# EAGLE design cob (EAGLE 8.1.1)
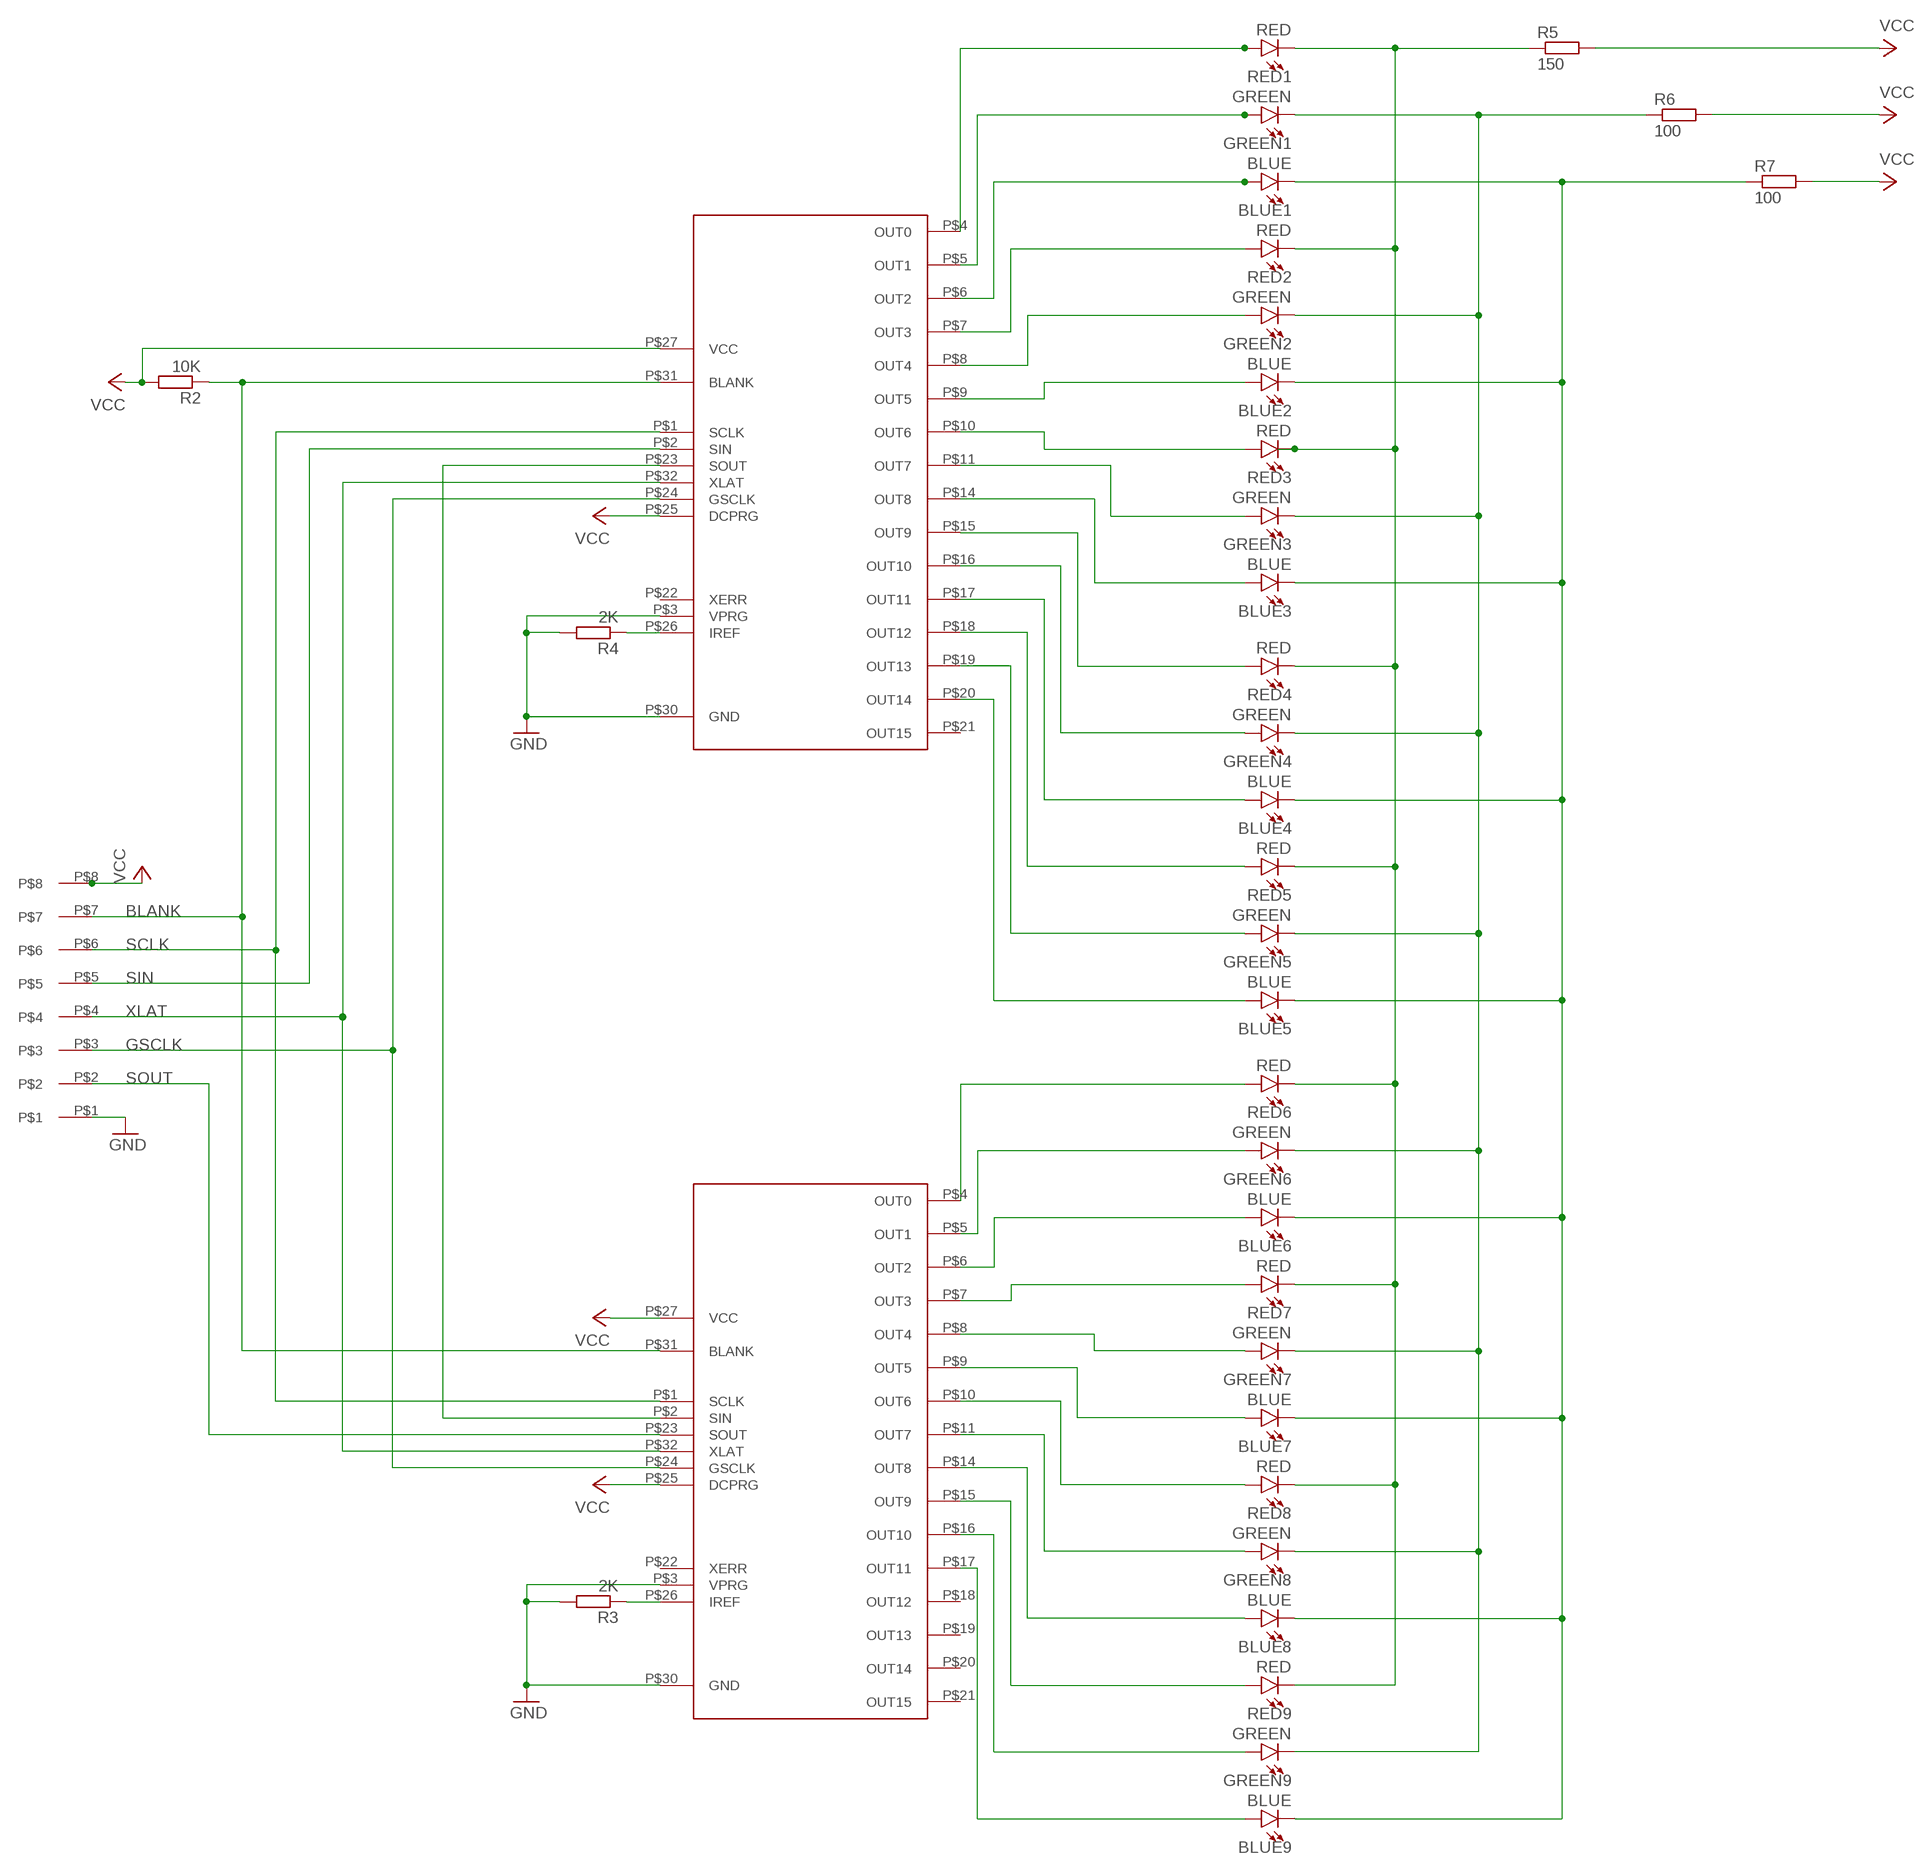
[diagram p0: schematic, sheet 1]

## Parts
BLUE1  BLUE  LED-BLUE0603  [LED-0603]
BLUE2  BLUE  LED-BLUE0603  [LED-0603]
BLUE3  BLUE  LED-BLUE0603  [LED-0603]
BLUE4  BLUE  LED-BLUE0603  [LED-0603]
BLUE5  BLUE  LED-BLUE0603  [LED-0603]
BLUE6  BLUE  LED-BLUE0603  [LED-0603]
BLUE7  BLUE  LED-BLUE0603  [LED-0603]
BLUE8  BLUE  LED-BLUE0603  [LED-0603]
BLUE9  BLUE  LED-BLUE0603  [LED-0603]
GREEN1  GREEN  LED-GREEN0603  [LED-0603]
GREEN2  GREEN  LED-GREEN0603  [LED-0603]
GREEN3  GREEN  LED-GREEN0603  [LED-0603]
GREEN4  GREEN  LED-GREEN0603  [LED-0603]
GREEN5  GREEN  LED-GREEN0603  [LED-0603]
GREEN6  GREEN  LED-GREEN0603  [LED-0603]
GREEN7  GREEN  LED-GREEN0603  [LED-0603]
GREEN8  GREEN  LED-GREEN0603  [LED-0603]
GREEN9  GREEN  LED-GREEN0603  [LED-0603]
R2  10K  R-EU_R0402  [R0402]
R3  2K  R-EU_R0402  [R0402]
R4  2K  R-EU_R0402  [R0402]
R5  150  R-EU_R1206  [R1206]
R6  100  R-EU_R1206  [R1206]
R7  100  R-EU_R1206  [R1206]
RED1  RED  LED-RED0603  [LED-0603]
RED2  RED  LED-RED0603  [LED-0603]
RED3  RED  LED-RED0603  [LED-0603]
RED4  RED  LED-RED0603  [LED-0603]
RED5  RED  LED-RED0603  [LED-0603]
RED6  RED  LED-RED0603  [LED-0603]
RED7  RED  LED-RED0603  [LED-0603]
RED8  RED  LED-RED0603  [LED-0603]
RED9  RED  LED-RED0603  [LED-0603]
U$1  TLC5940  [RHB]
U$2  TLC5940  [RHB]
U$3  8PIN  [8PIN]

## Nets
BLANK: R2.1 U$1.P$31(BLANK) U$2.P$31(BLANK) U$3.P$7
GND: R3.2 R4.2 U$1.P$3(VPRG) U$1.P$30(GND) U$2.P$3(VPRG) U$2.P$30(GND) U$3.P$1
GSCLK: U$1.P$24(GSCLK) U$2.P$24(GSCLK) U$3.P$3
N$1: RED1.A U$1.P$4(OUT0)
N$2: GREEN1.A U$1.P$5(OUT1)
N$3: RED2.A U$1.P$7(OUT3)
N$4: R4.1 U$1.P$26(IREF)
N$5: R3.1 U$2.P$26(IREF)
N$9: BLUE3.A U$1.P$14(OUT8)
N$10: BLUE2.A U$1.P$9(OUT5)
N$11: U$1.P$23(SOUT) U$2.P$2(SIN)
N$12: BLUE1.A U$1.P$6(OUT2)
N$13: GREEN2.A U$1.P$8(OUT4)
N$14: RED3.A U$1.P$10(OUT6)
N$15: GREEN3.A U$1.P$11(OUT7)
N$16: RED4.A U$1.P$15(OUT9)
N$17: GREEN4.A U$1.P$16(OUT10)
N$18: BLUE4.A U$1.P$17(OUT11)
N$19: RED5.A U$1.P$18(OUT12)
N$20: GREEN5.A U$1.P$19(OUT13)
N$21: BLUE5.A U$1.P$20(OUT14)
N$22: BLUE6.A U$2.P$6(OUT2)
N$23: GREEN6.A U$2.P$5(OUT1)
N$24: RED6.A U$2.P$4(OUT0)
N$25: RED7.A U$2.P$7(OUT3)
N$26: GREEN7.A U$2.P$8(OUT4)
N$27: BLUE7.A U$2.P$9(OUT5)
N$28: RED8.A U$2.P$10(OUT6)
N$29: GREEN8.A U$2.P$11(OUT7)
N$30: BLUE8.A U$2.P$14(OUT8)
N$31: BLUE9.A U$2.P$17(OUT11)
N$32: GREEN9.A U$2.P$16(OUT10)
N$33: RED9.A U$2.P$15(OUT9)
N$36: R5.1 RED1.C RED2.C RED3.C RED4.C RED5.C RED6.C RED7.C RED8.C RED9.C
N$38: GREEN1.C GREEN2.C GREEN3.C GREEN4.C GREEN5.C GREEN6.C GREEN7.C GREEN8.C GREEN9.C R6.1
N$39: BLUE1.C BLUE2.C BLUE3.C BLUE4.C BLUE5.C BLUE6.C BLUE7.C BLUE8.C BLUE9.C R7.1
SCLK: U$1.P$1(SCLK) U$2.P$1(SCLK) U$3.P$6
SIN: U$1.P$2(SIN) U$3.P$5
SOUT: U$2.P$23(SOUT) U$3.P$2
VCC: R2.2 R5.2 R6.2 R7.2 U$1.P$25(DCPRG) U$1.P$27(VCC) U$2.P$25(DCPRG) U$2.P$27(VCC) U$3.P$8
XLAT: U$1.P$32(XLAT) U$2.P$32(XLAT) U$3.P$4
Unconnected: U$1.P$21(OUT15) U$1.P$22(XERR) U$2.P$18(OUT12) U$2.P$19(OUT13) U$2.P$20(OUT14) U$2.P$21(OUT15) U$2.P$22(XERR)

## Library data of the parts
BLUE1-BLUE9 = SparkFun-LED:LED-BLUE: Blue SMD LED Used in manufacturing of various products at SparkFun Packages: 0603 - SMD 0603 package [Product Link] <http://www.digikey.com/product-detail/en/SMLE12BC7TT86/511-1589-2-ND/1641808> 1206 - SMD1206 package [Product Link] <http://www.digikey.com/product-detail/en/lite-on-inc/LTST-C150TBKT/160-1643-1-ND/573584> SparkFun Products: ESP8266 Thing-Dev Board <https://www.sparkfun.com/products/13711> RedBoard <https://www.sparkfun.com/products/12757>; PROD_ID: DIO-08575
GREEN1-GREEN9 = SparkFun-LED:LED-GREEN: Green SMD LED Used in manufacturing of various products at SparkFun Packages: 0603 - SMD 0603 package [Product Link] <http://www.futureelectronics.com/en/technologies/semiconductors/optoelectronics/leds/Pages/9894312-LTST-C190GKT.aspx?CrossPart=HSMG-C190&IM=0> LilyPad 1206 - SMD1206 LilyPad package [Product Link] <http://www.futureelectronics.com/en/Technologies/Product.aspx?ProductID=IN150NGHARVATEKCORPORATION2049943&IM=0> 1206 - SMD1206 package [Product Link] <http://www.futureelectronics.com/en/technologies/semiconductors/optoelectronics/leds/Pages/8315665-LTST-C150KGKT.aspx?IM=0> 1206 Bottom Mount -SMD 1206 Bottom Mount [Product Link] <http://www.digikey.com/product-detail/en/lite-on-inc/LTST-C230KGKT/160-1456-1-ND/386854> SparkFun Products: Pro Mini 328 -5V <https://www.sparkfun.com/products/821> RedBoard <https://www.sparkfun.com/products/12757> MP3 Trigger <https://www.sparkfun.com/products/13720> Makey Makey <https://www.sparkfun.com/products/11076>; PROD_ID: DIO-00821
R2-R7 = resistor:R-EU_: RESISTOR, European symbol
RED1-RED9 = SparkFun-LED:LED-RED: Red SMD LED Used in manufacturing of most products at SparkFun Packages: 0603 - SMD 0603 package [Product Link] <http://docs.avagotech.com/docs/AV02-0551EN> 0603 SMART - SMD 0603 SMART package ( more efficient and expensive)[Product Link] <http://www.osram-os.com/Graphics/XPic2/00077099_0.pdf> 1206 - SMD1206 package [Product Link] <https://www.sparkfun.com/datasheets/DevTools/LilyPad/Q150OVS4.pdff> SparkFun Products: Pro Mini 328 -5V <https://www.sparkfun.com/products/821> RedBoard <https://www.sparkfun.com/products/12757> IOIO-OTG <https://www.sparkfun.com/products/13613>; PROD_ID: DIO-00819
U$1 U$2 = spinner:TLC5940
U$3 = spinner:8PIN

## Board
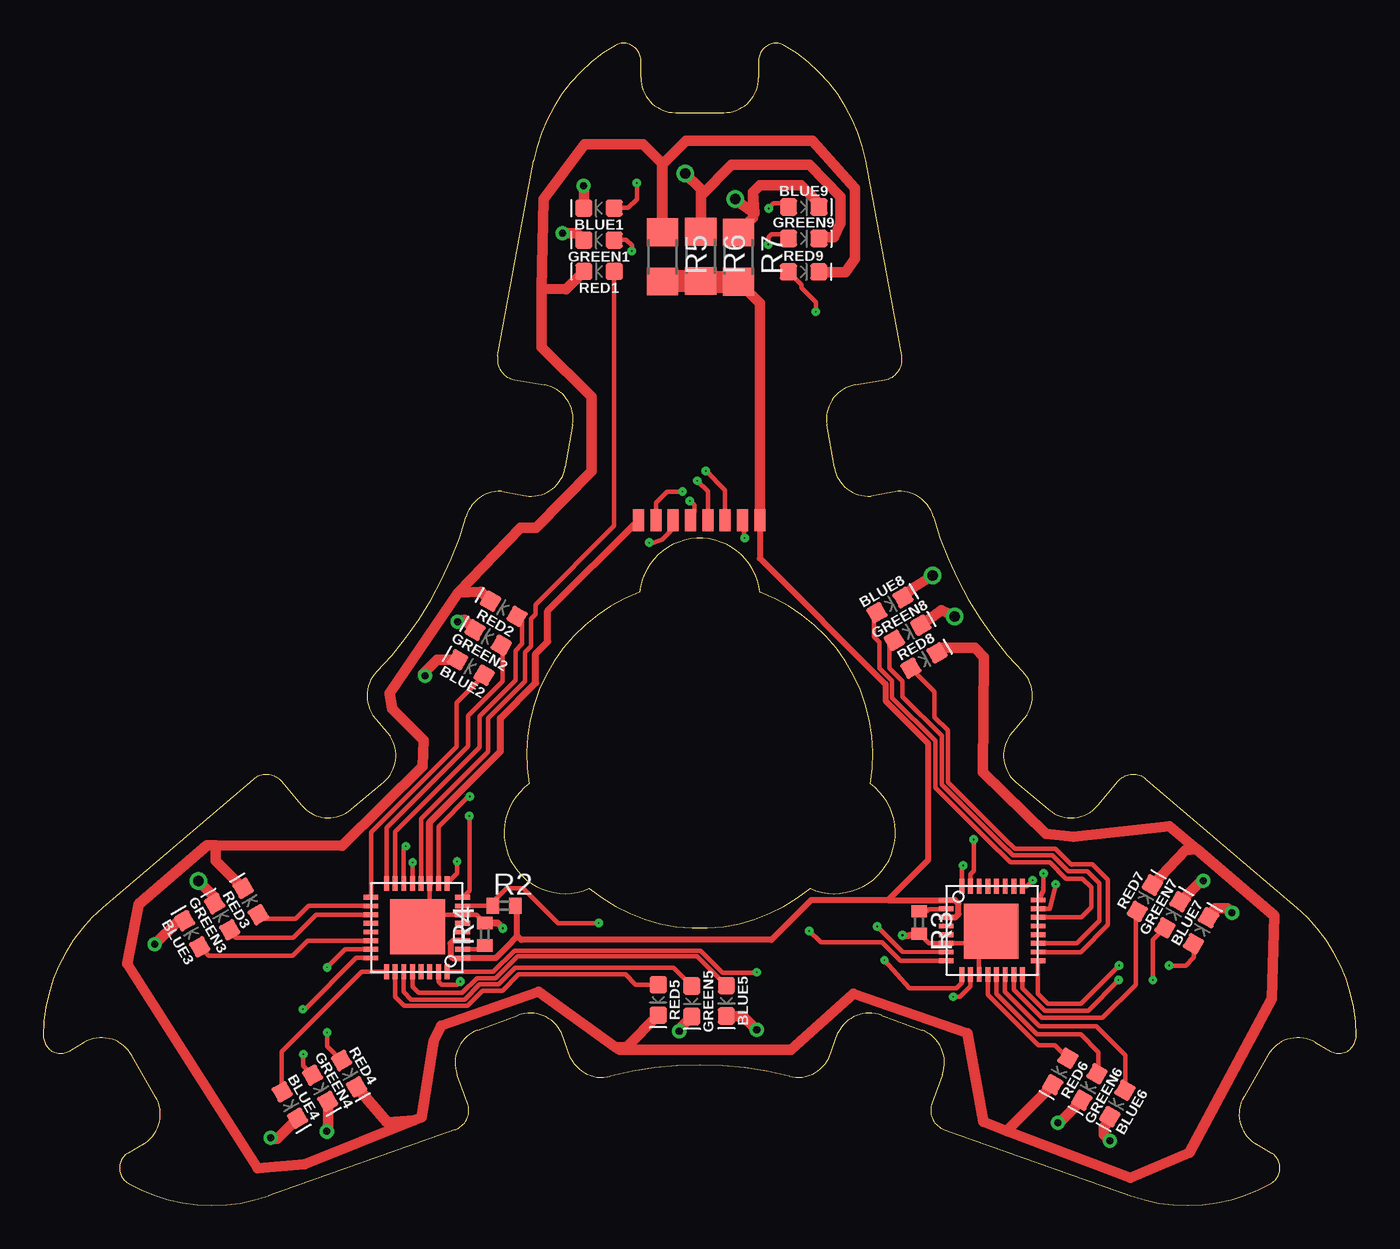
[diagram p1: board, top side]
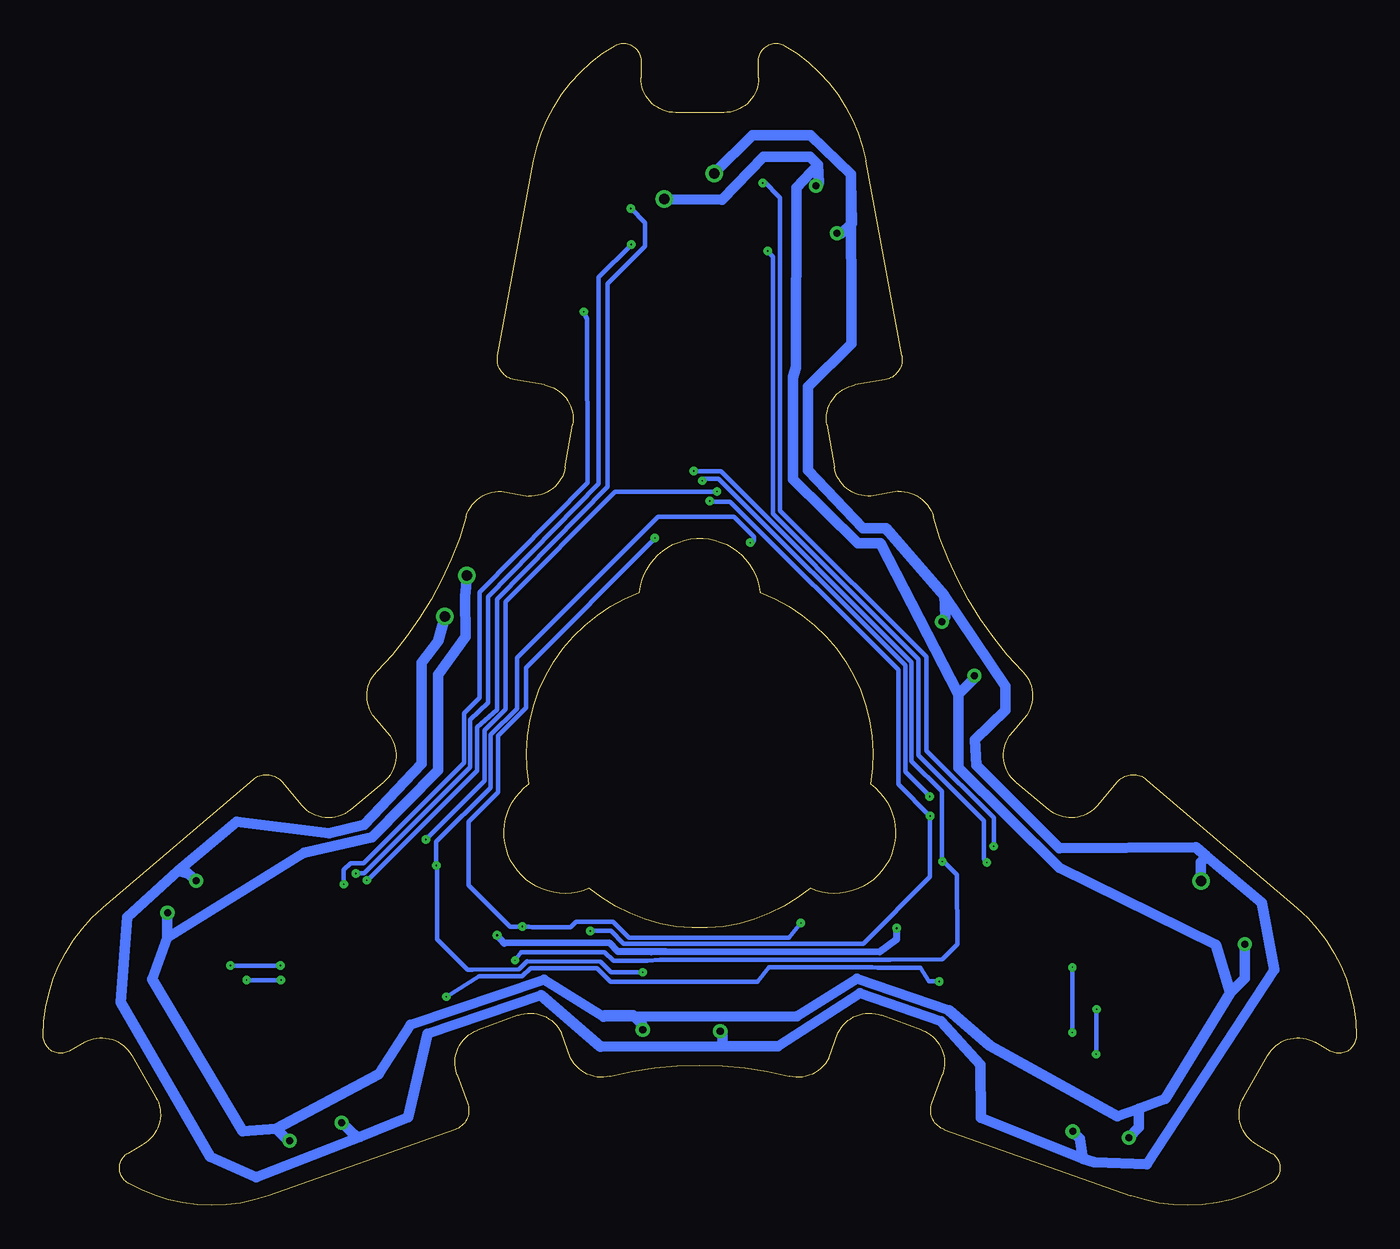
[diagram p2: board, bottom side, seen from below]

Size 75.79 x 67.06 mm. Coordinates in mm from the lower left corner, seen from the top.
Outline: 43.06,7.45 arc14 37.9,8.09
Outline: 4.9,1.29 arc49 13.01,0.56
Outline: 30.44,8.49 arc77 32.73,7.45
Outline: 27.41,10.98 arc-84 29.9,9.97 arc84 27.41,10.98
Outline: 20.02,27.09 arc-84 19.65,24.43 17.73,22.84 arc-41 16.41,22.37 arc-49 14.92,23.09 13.8,24.44
Outline: 2.37,9.41 arc-90 5.1,8.68 6.49,6.26 arc-90 5.76,3.53
Outline: 25.08,10.12 arc90 23.89,7.55
Outline: 13.8,24.44 arc91 12.1,24.58
Outline: 23.77,4.38 arc91 24.49,5.91
Outline: 4.9,1.29 arc-120 4.9,3.03 5.78,3.53
Outline: 22.39,34.95 arc-14 19.25,30.8 arc77 19.01,28.3 20.03,27.1
Outline: 22.39,34.95 arc14 24.42,39.75
Outline: 24.42,39.75 arc-77 26.46,41.21 28.01,40.93
Outline: 28.01,40.94 arc84 30.13,42.59 30.55,45.04 arc90 28.92,47.35 27.2,47.65
Outline: 26.23,49.05 arc91 27.2,47.65
Outline: 34.5,66.07 arc120 33,66.93
Outline: 37.9,8.09 arc14 32.73,7.45
Outline: 51.3,5.91 arc91 52.02,4.38
Outline: 43.06,7.45 arc77 45.35,8.49
Outline: 48.38,10.98 arc84 45.89,9.97 arc-84 48.38,10.98
Outline: 51.9,7.55 arc90 50.72,10.12
Outline: 70.03,3.53 arc-90 69.3,6.26 70.69,8.68 arc-90 73.43,9.41
Outline: 70.89,1.29 arc120 70.89,3.03 70.03,3.53
Outline: 62.78,0.56 arc49 70.89,1.29
Outline: 55.77,27.09 arc84 56.15,24.43 58.06,22.84 arc90 60.87,23.09 61.99,24.44 arc-91 63.69,24.58 72.37,17.17 arc-49 75.79,9.78 arc-120 74.29,8.91 73.41,9.42
Outline: 51.37,39.75 arc14 53.4,34.96
Outline: 53.4,34.96 arc14 56.54,30.8 arc-77 56.78,28.3 55.77,27.1
Outline: 33,66.93 arc49 28.31,60.27 26.23,49.05
Outline: 51.37,39.75 arc77 49.33,41.21
Outline: 45.66,42.59 arc84 47.78,40.94 arc-84 45.66,42.59
Outline: 46.87,47.35 arc90 45.24,45.04
Outline: 48.59,47.65 arc91 49.56,49.05
Outline: 52.02,4.38 62.78,0.56
Outline: 24.49,5.91 23.89,7.55
Outline: 48.38,10.98 50.72,10.12
Outline: 30.44,8.49 29.91,9.97
Outline: 12.1,24.58 3.42,17.17 arc49 0,9.78 arc120 1.5,8.91 2.38,9.42
Outline: 34.5,66.07 34.5,65.07 arc90 36.5,63.07 39.29,63.07 arc90 41.29,65.07 41.29,66.07 arc-120 42.79,66.93 arc-49 47.48,60.27 49.56,49.05
Outline: 49.33,41.21 47.78,40.93
Outline: 45.66,42.59 45.24,45.04
Outline: 46.87,47.35 48.59,47.65
Outline: 45.35,8.49 45.88,9.97
Outline: 25.08,10.12 27.41,10.98
Outline: 51.9,7.55 51.3,5.91
Outline: 23.77,4.38 13.01,0.56
Outline: 43.06,7.45 arc14 37.9,8.09
Outline: 4.9,1.29 arc49 13.01,0.56
Outline: 30.44,8.49 arc77 32.73,7.45
Outline: 25.08,10.12 arc90 23.89,7.55
Outline: 13.8,24.44 arc91 12.1,24.58
Outline: 23.77,4.38 arc91 24.49,5.91
Outline: 22.39,34.95 arc14 24.42,39.75
Outline: 26.23,49.05 arc91 27.2,47.65
Outline: 34.5,66.07 arc120 33,66.93
Outline: 37.9,8.09 arc14 32.73,7.45
Outline: 51.3,5.91 arc91 52.02,4.38
Outline: 43.06,7.45 arc77 45.35,8.49
Outline: 51.9,7.55 arc90 50.72,10.12
Outline: 62.78,0.56 arc49 70.89,1.29
Outline: 51.37,39.75 arc14 53.4,34.96
Outline: 51.37,39.75 arc77 49.33,41.21
Outline: 46.87,47.35 arc90 45.24,45.04
Outline: 48.59,47.65 arc91 49.56,49.05
Outline: 28.04,24.33 arc168 31.52,18.3 arc79 44.27,18.3 arc168 47.75,24.33 arc79 41.38,35.38 arc168 34.42,35.38 arc79 28.04,24.33
Copper layers (1*16): Top 0.035mm / dielectric 1.5mm / Bottom 0.035mm
Design rules "default": minimum track width 10mil, minimum drill 24mil, track to track 8mil, track to pad 8mil, pad to pad 8mil, via to via 8mil, smd to smd 8mil, copper to edge 40mil, drill to drill 8mil, minimum pad ring 10mil, minimum via ring 8mil, stop-mask expansion 4mil, vias tented up to drill 0mil, thermal gap 10mil

### Footprints (pad centres in the part's own frame; a part is rotated, then mirrored left to right if it is on the bottom)
LED-0603 = smd 1 x 1: A -0.877,0; C 0.877,0
R0402 = smd 0.7 x 0.9: 1 -0.65,0; 2 0.65,0
R1206 = smd 1.6 x 1.803: 1 -1.422,0; 2 1.422,0
RHB = smd 0.28 x 0.85: P$1 0,-5.1; P$2 0.5,-5.1; P$3 1,-5.1; P$4 1.5,-5.1; P$5 2,-5.1; P$6 2.5,-5.1; P$7 3,-5.1; P$8 3.5,-5.1; P$17 3.5,0; P$18 3,0; P$19 2.5,0; P$20 2,0; P$21 1.5,0; P$22 1,0; P$23 0.5,0; P$24 0,0 | smd 0.85 x 0.28: P$9 4.4,-4.3; P$10 4.4,-3.8; P$11 4.4,-3.3; P$12 4.4,-2.8; P$13 4.4,-2.3; P$14 4.4,-1.8; P$15 4.4,-1.3; P$16 4.4,-0.8; P$25 -0.9,-0.8; P$26 -0.9,-1.3; P$27 -0.9,-1.8; P$28 -0.9,-2.3; P$29 -0.9,-2.8; P$30 -0.9,-3.3; P$31 -0.9,-3.8; P$32 -0.9,-4.3 | smd 3.15 x 3.15: P$33 1.7,-2.6
8PIN = smd 0.635 x 1.27: P$1 0,0; P$2 1,0; P$3 2,0; P$4 3,0; P$5 4,0; P$6 5,0; P$7 6,0; P$8 7,0

### Placement (x,y rotation side)
BLUE1  32.08,57.56 180 top
BLUE2  24.68,31.04 150 top
BLUE3  8.6,15.68 120 top
BLUE4  14.24,5.79 300 top
BLUE5  39.43,11.81 270 top
BLUE6  62.01,5.88 240 top
BLUE7  66.83,15.85 60 top
BLUE8  48.88,34.65 30 top
BLUE9  43.9,57.62 0 top
GREEN1  32.08,55.71 180 top
GREEN2  25.68,32.77 150 top
GREEN3  10.32,16.66 120 top
GREEN4  15.98,6.76 300 top
GREEN5  37.44,11.78 270 top
GREEN6  60.39,6.83 240 top
GREEN7  65.19,16.78 60 top
GREEN8  49.89,33.04 30 top
GREEN9  43.9,55.8 0 top
R2  26.6,17.29 0 top
R3  50.55,16.34 270 top
R4  25.49,15.65 90 top
R5  35.75,54.74 270 top
R6  37.96,54.77 270 top
R7  40.12,54.73 270 top
RED1  32.08,53.91 180 top
RED2  26.58,34.44 150 top
RED3  11.98,17.54 120 top
RED4  17.65,7.6 300 top
RED5  35.5,11.86 270 top
RED6  58.72,7.73 240 top
RED7  63.58,17.73 60 top
RED8  50.84,31.45 30 top
RED9  43.89,53.87 0 top
U$1  23.31,13.48 180 top
U$2  53.02,18.42 0 top
U$3  34.36,39.54 0 top

### Tracks (layer width: path | path; a pad name or v marks a point on that pad's centre or on a via)
BLANK  (via drill 0.08)
  Top 0.254: U$1.P$31 25.94,17.28 R2.1 25.95,17.54 26.73,18.32 27.69,18.32 29.73,16.28 32,16.28 32.02,16.3 v32.06,16.3 | v48.14,16.09 49.6,14.63 U$2.P$31 | U$3.P$7 40.44,39.46 40.44,38.44 40.48,38.48 v40.48,38.51
  Bottom 0.254: v32.06,16.3 32.75,15.46 41.99,15.46 42.89,16.38 45.05,16.38 45.36,16.06 47.57,16.06 47.75,16.08 v48.14,16.09 48.86,16.09 51.25,18.48 51.25,22.14 49.54,23.86 49.53,27.09 47.92,28.71 47.92,31.04 v40.48,38.51
GND  (via drill 0.1)
  Top 0.254: U$1.P$3 22.31,17.26 22.79,16.78 U$1.P$30 25.01,16.78 R4.2 | R3.2 51.11,15.13 U$2.P$30 52.13,15.13 53.43,15.13 54.02,14.54 U$2.P$3
  Top 0.406: R4.2 26.23,16.3 v26.53,16 | v49.59,15.6 49.76,15.58 R3.2 | U$1.P$3 22.31,22.12 26.4,26.21 26.4,28.13 28.43,30.16 28.43,31.84 29.12,32.53 29.12,34.31 U$3.P$1
  Bottom 0.406: v26.53,16 26.53,15.34 27.51,14.62 39.87,14.64 40.69,14.64 42.61,14.65 43.11,15.15 49.16,15.13 49.17,15.11 v49.59,15.6
GSCLK  (via drill 0.08)
  Top 0.254: U$1.P$24 25.96,13.48 27.19,14.71 37.92,14.71 39.22,13.42 41.15,13.42 v41.18,13.45 | v53.1,19.61 53.02,19.53 U$2.P$24 | U$3.P$3 36.28,39.46 36.22,38.9 35.73,38.41 34.97,38.16 34.99,38.14 v34.99,38.25
  Bottom 0.254: v41.18,13.45 43.01,13.45 43.63,14.07 47.87,14.08 48.32,13.62 51.01,13.61 51.29,13.61 53.07,15.36 53.07,19.58 v53.1,19.61 53.1,20.98 49.96,24.12 49.96,27.17 48.43,28.68 48.43,31.59 40.29,39.75 35.93,39.75 34.77,38.6 34.77,38.36 v34.99,38.25
N$1
  Top 0.254: U$1.P$4 21.81,22.31 25.68,26.18 25.68,28.12 27.81,30.25 27.81,31.92 28.16,32.28 28.16,33.86 28.42,34.11 28.42,34.68 32.96,39.22 RED1.A
N$2  (via drill 0.08)
  Top 0.254: U$1.P$5 21.31,19.78 21.3,19.79 21.31,19.79 v21.32,19.8 | v33.98,55.08 33.98,55.4 33.64,55.73 32.98,55.73 GREEN1.A
  Bottom 0.254: v21.32,19.8 21.49,19.97 21.49,22.19 25.29,25.99 25.29,31.53 33.67,39.92 33.67,54.76 33.98,55.06 v33.98,55.08
N$3
  Top 0.254: U$1.P$7 20.31,21.56 25.19,26.44 25.19,28.24 27.26,30.31 27.26,32.02 27.63,32.4 27.63,33.7 RED2.A
N$4
  Top 0.254: U$1.P$26 25.63,14.77 R4.1
N$5
  Top 0.254: U$2.P$26 52.09,17.1 51.13,17.1 51.02,16.99 R3.1
N$9
  Top 0.254: U$1.P$14 15.27,15.28 14.4,14.41 9.54,14.41 BLUE3.A
N$10
  Top 0.254: U$1.P$9 18.91,21.53 23.85,26.47 23.85,29 BLUE2.A
N$11  (via drill 0.08)
  Top 0.254: U$1.P$23 22.81,12.91 22.98,12.74 23.89,12.74 v24.07,12.93 | v52.52,12.04 52.93,12.05 53.52,12.64 53.52,13.25 U$2.P$2
  Bottom 0.254: v24.07,12.93 24.67,12.93 25.17,13.72 27.63,13.72 27.94,13.74 33.89,13.74 34.55,12.9 43.04,12.9 43.83,13.69 47.67,13.7 48.14,13.24 50.64,13.22 v52.52,12.04
N$12  (via drill 0.08)
  Top 0.254: U$1.P$6 20.81,20.57 20.92,20.68 v20.92,20.73 | v34.27,59 34.27,58.07 33.76,57.56 BLUE1.A
  Bottom 0.254: v20.92,20.73 20.92,22.36 24.81,26.25 24.81,31.67 33.25,40.08 33.25,58.15 34.22,59.14 34.22,59.05 v34.27,59
N$13
  Top 0.254: U$1.P$8 19.81,21.79 24.52,26.49 24.52,28.27 26.5,30.25 26.5,32.26 GREEN2.A
N$14
  Top 0.254: U$1.P$10 15.31,17.28 14.56,16.53 12.67,16.53 RED3.A
N$15
  Top 0.254: U$1.P$11 15.75,16.78 14.42,15.46 11.09,15.46 10.76,15.79 GREEN3.A
N$16  (via drill 0.08)
  Top 0.254: U$1.P$15 17.42,14.78 v16.38,13.74 | v16.38,9.98 16.38,9.19 RED4.A
  Bottom 0.254: v16.38,13.74 v16.38,9.98
N$17  (via drill 0.08)
  Top 0.254: U$1.P$16 18.07,14.28 15.11,11.32 v14.99,11.32 v14.99,11.33 | v15.01,8.72 15.01,8.05 GREEN4.A
  Bottom 0.254: v14.99,11.33 14.99,8.75 v15.01,8.72
N$18
  Top 0.254: U$1.P$17 18.37,13.48 13.75,8.86 13.75,6.6 BLUE4.A
N$19
  Top 0.254: U$1.P$18 20.31,12.04 20.84,11.52 24.49,11.52 25.36,12.39 26.5,12.39 27.44,13.33 33.6,13.33 34.2,12.74 RED5.A
N$20
  Top 0.254: U$1.P$19 20.81,12.33 21.22,11.88 24.31,11.88 25.18,12.76 26.28,12.76 27.24,13.72 36.38,13.72 GREEN5.A
N$21
  Top 0.254: U$1.P$20 21.31,12.61 21.65,12.27 24.19,12.27 25.03,13.11 26.1,13.11 27.37,14.37 37.75,14.37 BLUE5.A
N$22
  Top 0.254: U$2.P$6 55.52,12.35 57.52,10.35 60.8,10.35 62.47,8.68 62.47,6.67 BLUE6.A
N$23
  Top 0.254: U$2.P$5 55.02,12.22 57.37,9.87 59.88,9.87 60.91,8.84 60.91,7.68 GREEN6.A
N$24
  Top 0.254: U$2.P$4 54.52,12.15 57.44,9.24 58.41,9.24 RED6.A
N$25
  Top 0.254: U$2.P$7 56.02,12.45 57.64,10.83 61.15,10.83 63.06,12.74 63.06,16.89 RED7.A
N$26  (via drill 0.08)
  Top 0.254: U$2.P$8 56.52,12.54 57.81,11.25 60.33,11.25 62.03,12.96 62.03,12.97 v62.06,13 | v64.05,13 64.05,15.32 GREEN7.A
  Bottom 0.254: v62.06,13 v64.05,13
N$27  (via drill 0.08)
  Top 0.254: U$2.P$9 57.42,12.23 58,11.65 59.91,11.65 v62.1,13.84 | v64.99,13.84 65.95,13.84 66.43,14.33 66.43,15.06 BLUE7.A
  Bottom 0.254: v62.1,13.84 v64.99,13.84
N$28
  Top 0.254: U$2.P$10 59.89,14.63 61.45,16.19 61.45,18.8 60.57,19.68 59.49,19.68 | RED8.A 51.45,29.64 51.45,28.19 52.22,27.42 52.22,24.42 55.47,21.17 56.08,20.57 58.43,20.57 59.33,19.68 59.49,19.68 | 59.36,19.67 59.49,19.68
N$29
  Top 0.254: U$2.P$11 59.65,15.13 60.95,16.43 60.95,18.6 60.28,19.28 59.17,19.28 58.26,20.2 55.97,20.2 55.35,20.82 51.86,24.28 51.86,27.1 49.6,29.37 49.6,30.24 48.85,30.99 48.85,32.32 GREEN8.A 49.01,32.48
N$30
  Top 0.254: U$2.P$14 59.92,16.63 60.5,17.21 60.5,18.36 59.99,18.85 59.04,18.85 58.1,19.8 55.82,19.8 55.16,20.46 55.14,20.46 51.49,24.11 51.49,26.82 49,29.31 49,30.28 48.27,31.01 48.27,32.5 47.96,32.81 47.96,34.04 BLUE8.A
N$31  (via drill 0.08)
  Top 0.254: U$2.P$17 56.79,18.43 v57.11,18.76 | v41.87,57.53 41.87,57.57 42.15,57.84 42.8,57.84 BLUE9.A
  Bottom 0.254: v41.87,57.53 41.05,56.71 41.05,55.35 43.22,53.18 43.22,41.46 49.61,34.98 49.61,28.61 50.74,27.59 50.74,25.1 57.07,18.76 v57.11,18.76
N$32  (via drill 0.08)
  Top 0.254: U$2.P$16 57.44,17.63 57.75,18.15 v57.74,19.16 | v41.85,55.45 41.85,55.86 42.03,56.04 42.78,56.04 GREEN9.A
  Bottom 0.254: v41.85,55.45 41.85,55.41 43.75,53.57 43.75,41.65 50.12,35.14 50.12,29 51.14,28.02 51.14,25.28 57.27,19.16 v57.74,19.16
N$33  (via drill 0.08)
  Top 0.254: U$2.P$15 58.12,17.14 v58.45,18.53 | v44.6,51.57 44.6,52.13 43.76,52.97 43.76,53.13 RED9.A
  Bottom 0.254: v44.6,51.57 44.39,51.15 44.38,41.71 50.61,35.39 50.61,29.3 51.51,28.39 51.51,25.54 57.3,19.76 58.05,19.76 58.45,19.36 v58.45,18.53
N$36
  Top 0.61: 23.94,35.36 27.55,39.11 28.45,39.11 31.66,42.36 31.64,46.68 28.75,49.53 28.75,52.89 | 23.94,35.36 20.01,29.56 20.13,28.65 21.94,26.84 21.89,25.35 17.26,20.76 9.94,20.79 | 9.94,20.79 9.45,20.79 5.5,17.39 4.85,13.95 12.39,2.14 15.07,2.38 21.41,4.92 | 21.41,4.92 21.82,5.08 22.53,9.46 22.97,10.36 28.59,12.32 33.04,9.14 | 28.75,52.89 28.86,58.07 31.25,61.25 34.63,61.25 35.73,60.16 35.73,56.19 R5.1 35.75,60.08 37.11,61.44 44.4,61.44 46.86,58.71 46.86,54.64 46.3,53.85 44.79,53.85 RED9.C | 33.04,9.14 33.3,8.97 43.16,8.99 46.78,12.23 53.35,9.93 54.26,4.82 55.66,4.28 | 55.66,4.28 62.77,1.6 66.16,3.04 70.92,11.93 71.07,16.71 66.6,20.55 | 66.6,20.55 65,21.89 59.45,21.29 57.89,21.45 54.24,25.01 54.3,31.64 53.77,32.17 51.88,32.17 RED8.C | RED1.C 30.18,52.88 28.75,52.89 | RED2.C 25.28,35.42 23.94,35.36 | RED3.C 9.94,19.9 9.94,20.79 | RED4.C 19.84,4.79 21.41,4.92 | RED5.C 33.65,9.14 33.04,9.14 | RED6.C 55.66,4.35 55.66,4.28 | RED7.C 65.94,20.49 66.6,20.55
N$38  (via drill 0.41, 0.6)
  Top 0.61: R6.1 37.96,58.28 | 37.96,58.28 39.73,60.05 44.22,60.05 46.01,58.2 46.01,56.68 45.63,55.87 44.85,55.87 GREEN9.C | 37.96,58.28 37.96,58.63 37,59.59 37.03,59.59 v37.06,59.56 | v52.6,34 51.85,34.36 GREEN8.C | GREEN3.C 9.88,17.79 8.96,18.71 v8.96,18.73 | v23.91,33.67 24.31,33.81 GREEN2.C | GREEN4.C 16.44,5.99 16.44,4.38 16.37,4.31 v16.37,4.27 | GREEN5.C 36.73,10.2 36.73,10.02 36.71,10.04 v36.71,10.06 | GREEN1.C 30.82,56.09 v29.97,56.09 | GREEN6.C 58.65,4.78 v58.56,4.78 v58.56,4.77 | GREEN7.C 66.81,18.72 66.97,18.72 v66.97,18.74
  Bottom 0.61: v37.06,59.56 34.85,61.77 31.49,61.75 29.18,59.52 | 29.18,59.52 29.14,49.71 31.65,47.23 31.64,42.41 28.47,39.09 27.16,39.09 23.78,35.18 | 23.78,35.18 20.26,29.96 20.26,28.59 22.01,26.86 21.93,25.4 17.14,20.61 9.25,20.68 8.64,20.15 | 8.64,20.15 5.46,17.46 4.73,13.59 12.07,2.38 15.11,2.48 15.78,2.69 | 15.78,2.69 21.67,5.05 21.7,8.13 23.96,10.64 28.65,12.24 33.39,9.2 36.58,9.19 | 36.58,9.19 43.63,9.16 47.05,12.14 53.6,9.9 54.73,5.09 57.5,3.95 | 57.5,3.95 63.51,1.64 66.14,2.8 71.33,11.72 70.93,16.63 68.01,19.32 | 68.01,19.32 64.63,22.14 59.29,21.49 57.27,21.96 53.95,25.49 53.95,31.32 53,32.57 v52.6,34 | v8.96,18.73 8.96,19.79 8.64,20.15 | 23.78,35.18 23.71,33.97 23.77,33.91 23.8,33.91 v23.91,33.67 | v16.37,4.27 15.95,3.85 15.78,2.69 | v36.71,10.06 36.58,9.93 36.58,9.19 | 29.18,59.52 29.17,59.19 29.12,56.67 29.7,56.09 v29.97,56.09 | v58.56,4.77 57.68,3.93 57.5,3.95 | v66.97,18.74 67.45,19.18 68.01,19.32
N$39  (via drill 0.41, 0.6)
  Top 0.61: BLUE9.C 44.78,57.83 43.75,58.86 41.36,58.86 40.98,58.48 | 40.98,58.48 40.98,57.01 R7.1 | 40.98,58.48 41.05,57.25 39.93,58.05 v39.93,58.08 | v51.33,36.35 50.17,35.62 BLUE8.C | BLUE2.C 22.73,31.48 21.94,30.69 21.94,30.67 v22.04,30.56 | BLUE3.C 7.8,16.44 v6.44,15.07 | BLUE4.C 13.49,3.85 13.24,3.85 13.18,3.91 v13.13,3.91 | v41.18,10.13 40.39,10.93 BLUE5.C | BLUE1.C 31.21,58.79 31.19,58.81 v31.19,58.84 | v61.56,3.74 61.22,4.09 61.22,4.55 61.57,4.9 BLUE6.C | v68.62,16.88 68.36,17.15 67.65,17.15 67.27,16.77 BLUE7.C
  Bottom 0.61: v39.93,58.08 36.61,58.05 34.22,60.51 31.53,60.51 31.06,60.05 | 31.06,60.05 32.3,58.74 32.33,48.37 32.52,47.81 32.51,41.92 28.76,38.21 27.48,38.21 22.98,29.49 | 22.98,29.49 22.96,25.25 17.13,19.47 8.1,15.05 7.28,12.28 | 7.28,12.28 11,6.15 12.54,5.59 | 12.54,5.59 13.77,5.13 21.16,9.21 23.51,11.28 28.83,13.07 32.29,10.92 43.45,10.89 | 43.45,10.89 46.88,13.03 54.6,10.44 56.44,7.57 62.35,4.43 | 62.35,4.43 64.27,4.27 69.51,13.06 68.65,15.46 | 68.65,15.46 60.72,20.35 56.8,21.25 53.01,25.13 53.01,30.62 51.42,32.81 51.44,35.13 v51.33,36.35 | v22.04,30.56 22.04,30.42 22.98,29.49 | v6.44,15.07 6.44,13.12 7.28,12.28 | v13.13,3.91 12.54,4.5 12.54,5.59 | 43.45,10.89 43.37,10.97 41.75,10.97 41.23,10.45 41.23,10.18 v41.18,10.13 | v41.18,10.13 | v31.19,58.84 31.01,59.02 31.06,60.05 | 62.35,4.43 61.64,3.72 61.56,3.72 v61.56,3.74 | 68.65,15.46 68.63,15.47 v68.63,16.87 v68.62,16.88
SCLK  (via drill 0.08)
  Top 0.254: U$2.P$1 53.02,12.86 52.71,12.55 50,12.54 v48.56,14.15 | v23.89,19.85 23.89,19.16 U$1.P$1 | v38.24,42.39 39.36,41.28 U$3.P$6
  Bottom 0.254: v48.56,14.15 48.22,14.61 43.38,14.61 42.88,14.11 40.9,14.11 40.2,14.19 27.64,14.19 26.88,14.19 23.9,14.2 23.03,15.07 23.04,19.09 23.85,19.9 23.85,19.89 v23.89,19.85 23.93,19.89 23.93,23.9 25.66,25.63 25.66,31.36 36.68,42.37 38.28,42.37 38.27,42.39 v38.24,42.39
SIN  (via drill 0.08)
  Top 0.254: U$1.P$2 22.81,21.86 24.58,23.63 v24.62,23.6 | v37.75,41.82 38.36,41.2 U$3.P$5
  Bottom 0.254: v24.62,23.6 26.03,25.02 26.03,31.17 36.81,41.95 37.67,41.95 37.75,41.87 v37.75,41.82
SOUT  (via drill 0.08)
  Top 0.254: U$2.P$23 | U$2.P$23 53.52,19.1 53.73,19.31 53.73,19.96 53.72,19.97 53.72,21.09 53.71,21.09 v53.71,21.11 | v36.9,41.2 36.02,41.2 35.38,40.56 35.38,39.56 U$3.P$2
  Bottom 0.254: v53.71,21.11 50.33,24.5 50.33,27.43 49.1,28.63 49.1,34.85 42.78,41.2 v36.9,41.2
VCC
  Top 0.254: U$1.P$27 | 24.23,14.26 U$1.P$25
  Top 0.356: U$1.P$27 23.67,15.28 23.51,15.12 23.51,14.41 23.64,14.28 U$1.P$25 26.12,14.28 26.95,15.11 27.35,15.57 | 27.35,15.57 27.35,17.2 R2.2 | U$2.P$27 52.65,16.63 52.84,16.81 52.84,17.41 52.63,17.61 U$2.P$25 48.76,17.63 | 48.76,17.63 44.32,17.63 42.03,15.33 27.59,15.33 27.35,15.57 | U$3.P$8 41.36,37.34 48.62,30.09 48.62,29.13 51.07,26.67 51.07,19.93 48.76,17.63
  Top 0.61: 37.92,53.32 R6.2 | 40.08,53.35 R7.2 41.36,52.07 U$3.P$8
  Top 1.27: R5.2 35.78,53.35 R6.2 38,53.31 R7.2
XLAT  (via drill 0.08)
  Top 0.254: U$1.P$32 24.59,18.17 v24.59,22.47 | v37.32,40.66 37.58,40.4 37.58,40.01 37.36,39.79 U$3.P$4 | U$2.P$32 49.48,14.14 48.42,15.19 44.88,15.18 44.17,15.89 44.18,15.89 v44.22,15.85
  Bottom 0.254: v37.32,40.66 37.28,40.62 36.14,40.62 26.44,30.92 26.44,24.32 v24.59,22.47 24.59,18.97 28.45,15.12 42.29,15.12 43.02,15.85 v44.22,15.85